# Altium schematic sheet Sht1-Schem.SchDoc
size A; SheetNumber: 1; SheetTotal: 1
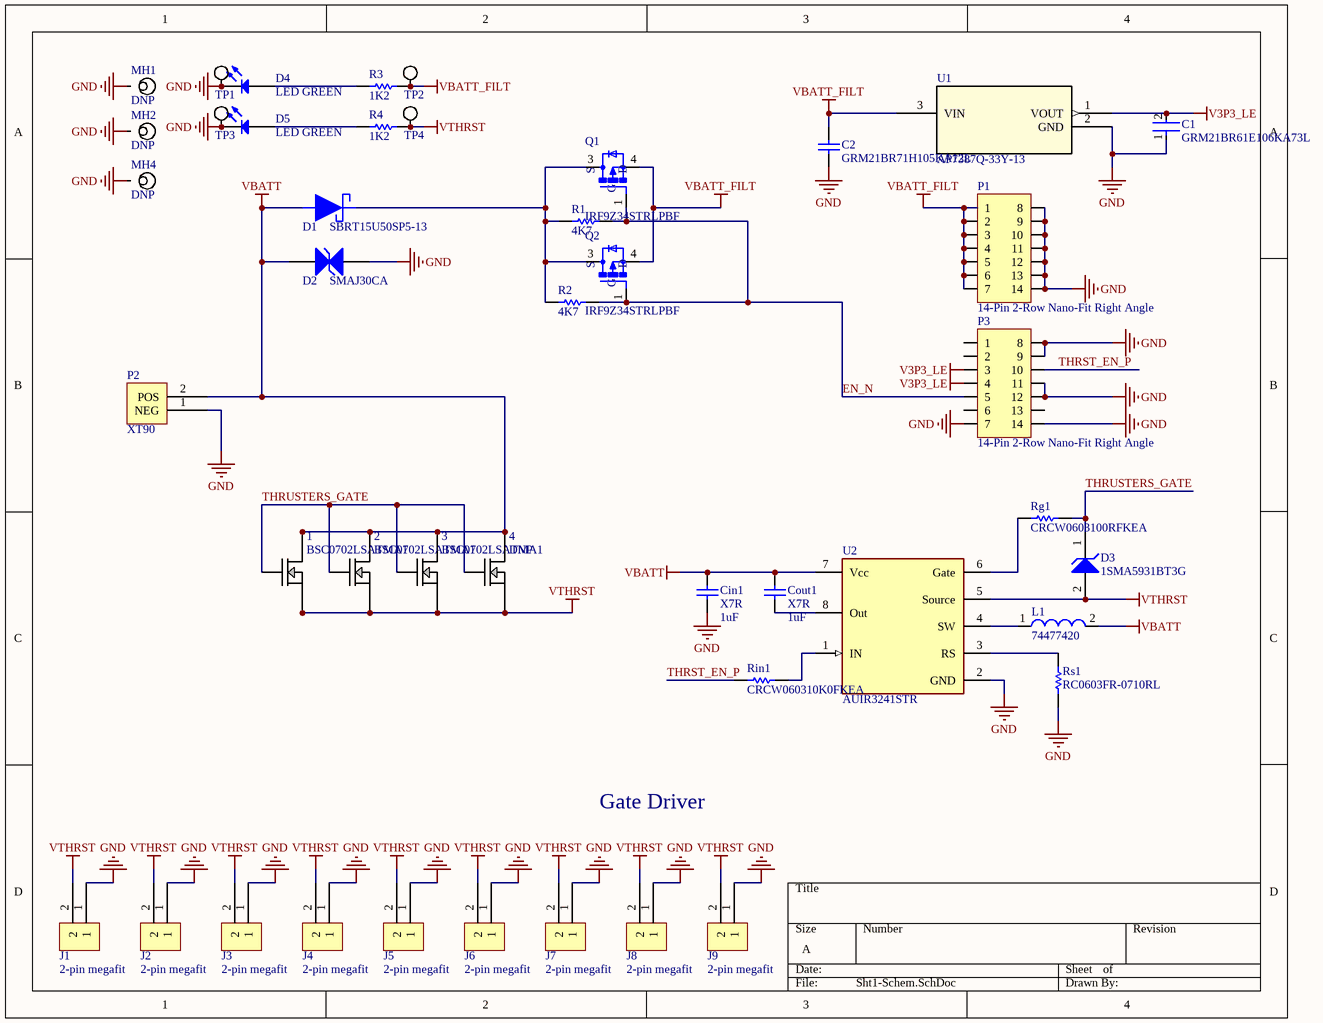
[diagram p0: Sht1-Schem.SchDoc]

## Parts
1  BSC0702LSATMA1  [TRANS_NexFET_Q5A]
2  BSC0702LSATMA1  [TRANS_NexFET_Q5A]
3  BSC0702LSATMA1  [TRANS_NexFET_Q5A]
4  DNP  [TRANS_NexFET_Q5A]
C1  GRM21BR61E106KA73L  [FP-GRM21B-0_15-IPC_C]
C2  GRM21BR71H105KA12L  [CAPC2013X135X45LL10T25]
Cin1  X7R  value 1uF  [C0805]
Cout1  X7R  value 1uF  [C0805]
D1  SBRT15U50SP5-13  [SBRT15U50SP5-13]
D2  SMAJ30CA  [LFUS-DO-214AC-A-2_V]
D3  1SMA5931BT3G  [ONSC-SMA-2-403D-02_F_V]
D4  LED GREEN  [LED_0805]
D5  LED GREEN  [LED_0805]
J1  2-pin megafit  [2-pin Megafit RA]
J2  2-pin megafit  [2-pin Megafit RA]
J3  2-pin megafit  [2-pin Megafit RA]
J4  2-pin megafit  [2-pin Megafit RA]
J5  2-pin megafit  [2-pin Megafit RA]
J6  2-pin megafit  [2-pin Megafit RA]
J7  2-pin megafit  [2-pin Megafit RA]
J8  2-pin megafit  [2-pin Megafit RA]
J9  2-pin megafit  [2-pin Megafit RA]
L1  74477420  [WE-PD2-M]
MH1  DNP  [Mounting Hole #4-40]
MH2  DNP  [Mounting Hole #4-40]
MH4  DNP  [Mounting Hole #4-40]
P1  14-Pin 2-Row Nano-Fit Right Angle  [MOLEX NANO-FIT 2X7 - Right Angle]
P2  XT90  [XT90]
P3  14-Pin 2-Row Nano-Fit Right Angle  [MOLEX NANO-FIT 2X7 - Right Angle]
Q1  IRF9Z34STRLPBF  [TO254P1521X483-4N]
Q2  IRF9Z34STRLPBF  [TO254P1521X483-4N]
R1  4K7  [RESC0603(1608)_L]
R2  4K7  [RESC0603(1608)_L]
R3  1K2  [RESC0603(1608)_L]
R4  1K2  [RESC0603(1608)_L]
Rg1  CRCW0603100RFKEA  [RESC1609X50X30ML8T20]
Rin1  CRCW060310K0FKEA  [RESC1609X50X30NL8T20]
Rs1  RC0603FR-0710RL  [RESC1608X55X25NL10T15]
TP1  Test Point Loop  [Test Point Loop - Black]  (value not drawn)
TP2  Test Point Loop  [Test Point Loop - Black]  (value not drawn)
TP3  Test Point Loop  [Test Point Loop - Black]  (value not drawn)
TP4  Test Point Loop  [Test Point Loop - Black]  (value not drawn)
U1  AP7387Q-33Y-13  [SOT-89-3_2P7X4P7_ONS]
U2  AUIR3241STR  [FP-PG-DSO-8-MFG]

## Nets
GND: C1.1 C2.1 Cin1.1 D2.2(A) D4.1(K) D5.1(K) J1.1 J2.1 J3.1 J4.1 J5.1 J6.1 J7.1 J8.1 J9.1 MH1.0 MH2.0 MH4.0 P1.8 P1.9 P1.10 P1.11 P1.12 P1.13 P1.14 P2.1(NEG) P3.7 P3.8 P3.9 P3.11 P3.12 P3.14 Rs1.1 TP1.1 TP3.1 U1.2(GND) U2.2(GND)
V3P3_LE: C1.2 P3.3 P3.4 U1.1(VOUT)
VBATT: 1.5(Drain) 1.6(Drain) 1.7(Drain) 1.8(Drain) 1.9(Drain) 2.5(Drain) 2.6(Drain) 2.7(Drain) 2.8(Drain) 2.9(Drain) 3.5(Drain) 3.6(Drain) 3.7(Drain) 3.8(Drain) 3.9(Drain) 4.5(Drain) 4.6(Drain) 4.7(Drain) 4.8(Drain) 4.9(Drain) Cin1.2 Cout1.2 D1.1 D2.1(A) L1.2 P2.2(POS) U2.7(Vcc)
VBATT_FILT: C2.2 P1.1 P1.2 P1.3 P1.4 P1.5 P1.6 P1.7 Q1.4(D) Q2.4(D) R3.2 TP2.1 U1.3(VIN)
VTHRST: 1.1(Source) 1.2(Source) 1.3(Source) 2.1(Source) 2.2(Source) 2.3(Source) 3.1(Source) 3.2(Source) 3.3(Source) 4.1(Source) 4.2(Source) 4.3(Source) D3.2(A) J1.2 J2.2 J3.2 J4.2 J5.2 J6.2 J7.2 J8.2 J9.2 R4.2 TP4.1 U2.5(Source)
EN_N: P3.5 Q1.1(G) Q2.1(G) R1.1 R2.1
THRST_EN_P: P3.10 Rin1.1
THRUSTERS_GATE: 1.4(Gate) 2.4(Gate) 3.4(Gate) 4.4(Gate) D3.1(K) Rg1.2
NetCout1_1: Cout1.1 U2.8(Out)
NetD1_2: D1.2 Q1.3(S) Q2.3(S) R1.2 R2.2
NetD4_2: D4.2(A) R3.1
NetD5_2: D5.2(A) R4.1
NetL1_1: L1.1 U2.4(SW)
NetRg1_1: Rg1.1 U2.6(Gate)
NetRin1_2: Rin1.2 U2.1(IN)
NetRs1_2: Rs1.2 U2.3(RS)

Not connected (* = marked no-connect by the designer): P3 1 2 6 13

## Notes on the sheet
- Gate Driver

## Library data of the parts
1-4 = BSC0702LSATMA1: No Description Available; Manufacturer_Part_Number: CSD18537NQ5A; VdsMax: 60.0; IdsMax: 50.0; Rdson45: 0.014559; QgTyp: 14.0; Vendor: Texas Instruments; Datasheet_URL: http://www.ti.com/lit/ds/symlink/csd18537nq5a.pdf; Quantity: 1; Manufacturer_Name: Texas Instruments; Copyright: Copyright (C) 2018 Accelerated Designs. All rights reserved; RefDes: RefDes; TYPE: TYPE; Value: Value
C1 = CMP-2007-03541-2: Chip Multilayer Ceramic Capacitors for General Purpose, 0805, 10uF, X5R, 15%, 10%, 25V; Length: 2mm; Depth: 1.25mm; Termination: SMD/SMT; Voltage: 25V; Height: 1.25mm; Material: Ceramic; Thickness: 0.053inch; Radiation Hardening: No; Min Operating Temperature: -55°C; Width: 0.049inch; Package Quantity: 1; Mount: Surface Mount; Dielectric: X5R; Packaging: Tape and Reel; Capacitance: 10uF; Voltage Rating (DC): 25V; Lead Free: Lead Free; Max Operating Temperature: 85°C; Case Code (Imperial): 0805; Case/Package: 0805; Tolerance: 10%; Voltage Rating: 25V; Case Code (Metric): 2012
C2 = CMP-1036-04761-2: 1uF; Manufacturer: Murata; Part Number: GRM21BR71H105KA12L
Cin1 Cout1 = Cap: Capacitor; Published: 8-Jun-2000; LatestRevisionDate: 17-Jul-2002; LatestRevisionNote: Re-released for DXP Platform.; PackageReference: RAD-0.3; Publisher: Altium Limited; PackageDescription: Radial Cap, Thru-Hole; 2 Leads; 0.3 in Pin Spacing
D1 = SBRT15U50SP5-13: Manufacturer: Diodes Incorporated; Diode Type: Super Barrier; Current - Average Rectified (Io): 15A; Speed: Fast Recovery =< 500ns, > 200mA (Io); Supplier 1: Digi-Key; Supplier Part Number 1: SBRT15U50SP5-13DICT-ND; Manufacturer Part Number: SBRT15U50SP5-13; RoHS: RoHS Compliant; Category: Discrete Semiconductor Products; Stock 1: 12134; Pricing 1: 1=0.93, 10=0.823, 100=0.6306, 500=0.49852, 1000=0.39882 (USD); Packaging: Cut Tape (CT); Part Status: Active; Capacitance @ Vr, F: -; Mounting Type: Surface Mount; Package / Case: PowerDI™ 5; Supplier Device Package: PowerDI®5; Operating Temperature - Junction: -65°C ~ 150°C; ComponentLink1URL: https://media.digikey.com/pdf/Data%20Sheets/Diodes%20PDFs/SBRT15U50SP5.pdf; ComponentLink1Description: https://media.digikey.com/pdf/Data%20Sheets/Diodes%20PDFs/SBRT15U50SP5.pdf
D2 = CMP-2000-07088-1: Transient Voltage Suppression Diode, 30 V, -65 to 150 degC, 2-Pin SMD, RoHS, Tape and Reel; Manufacturer: Littelfuse-Inc.; Current - Peak Pulse (10/1000µs): 8.3A; Power - Peak Pulse: 400W; Voltage - Breakdown (Min): 33.3V; Bidirectional Channels: 1; Power Line Protection: No; Voltage - Clamping (Max) @ Ipp: 48.4V; Voltage - Reverse Standoff (Typ): 30V; Type: Zener; Category: CircuitProtection; Datasheet Version: 11/2015; Package Description: 2-Pin Surface Mount Device, Body 4.295 x 2.595 mm; Family: TVS-Diodes; Manufacturer URL: http://www.littelfuse.com/; Series: SMAJ; Package / Case: DO-214AC,SMA; Capacitance @ Frequency: -; Package Reference: DO-214AC; Packaging: Digi-Reel®; Applications: GeneralPurpose; Mounting Technology: SurfaceMount; Mounting Type: SurfaceMount; Unidirectional Channels: -; Supplier Device Package: DO-214AC(SMA); Operating Temperature: -55°C~150°C(TJ); Datasheet URL: http://www.littelfuse.com/~/media/electronics/datasheets/tvs_diodes/littelfuse_tvs_diode_smaj_datasheet.pdf.pdf
D3 = CMP-1060-00118-1: 1.5 W Zener Voltage Regulator, 2-Pin SMA, Pb-Free, Tape and Reel; Manufacturer: On Semiconductor; VZ Typ (V): 18; Mounting Technology: Surface Mount; RoHS: Pb-Free; PackageDescription: 2-Pin Small Molded Package, J-Bend Lead, Body 2.605 x 4.315 mm; ComponentLink2Description: Datasheet; DatasheetVersion: Rev. 8; ComponentLink2URL: http://www.onsemi.com/pub_link/Collateral/1SMA5913BT3-D.PDF; ComponentLink3URL: http://www.onsemi.com/pub_link/Collateral/1SMA5913BT3-D.PDF; ComponentLink1URL: http://www.onsemi.com/; ComponentLink1Description: Manufacturer URL; Packing: Tape and Reel; ComponentLink3Description: Package Specification; PackageVersion: Rev. F, 11/2008; PartNumber: 1SMA5931BT3G; PackageReference: SMA-2-403D-02_F
D4 D5 = LED0: led; Manufacturer: Lite-On Inc.; Manufacturer Part Number: LTST-C171KGKT; Lens Color: Colorless; Lens Transparency: Clear; Millicandela Rating: 35mcd; Lens Style/Size: Rectangle with Flat Top, 1.40mm x 1.25mm; Voltage - Forward (Vf) (Typ): 2V; Current - Test: 20mA; Viewing Angle: 130°; Wavelength - Dominant: 571nm; Wavelength - Peak: 574nm; Supplier 1: Digi-Key; Supplier Part Number 1: 160-1426-1-ND; RoHS: RoHS Compliant; Category: Optoelectronics; Stock 1: 350441; Pricing 1: 1=0.31, 10=0.225, 25=0.1656, 100=0.1183, 250=0.0804, 500=0.07096, 1000=0.05558 (USD); Packaging: Cut Tape (CT); Part Status: Active; Color: Green; Mounting Type: Surface Mount; Features: -; Package / Case: 0805 (2012 Metric); Size / Dimension: 2.00mm L x 1.25mm W; Height (Max): 0.90mm; ComponentLink1URL: http://optoelectronics.liteon.com/upload/download/DS22-2000-118/LTST-C171KGKT.pdf; ComponentLink1Description: http://optoelectronics.liteon.com/upload/download/DS22-2000-118/LTST-C171KGKT.pdf
L1 = CMP-0227-00441-1: SMD Power Inductor WE-PD2, L = 100 µH; Inductance: 100 ÂµH; ComponentLink2Description: Datasheet; ComponentLink1URL: http://www.we-online.com; DatasheetVersion: ver 2, Jun-2005; ComponentLink2URL: http://www.we-online.de/katalog/media/pdf/74477420.pdf; PackageDescription: SMD Inductor, 2-Leads, Body 5.8 x 5.2 mm; PackageVersion: 2005; ComponentLink1Description: Manufacturer Link; PackageReference: WE-PD2-M
MH1 MH2 MH4 = Mounting Hole #4-40, Loose Fit: Mounting Hole for ANSI #4-40 w/ Flat Washer, Loose Fit; Datasheet: http://blogs.mentor.com/tom-hausherr/blog/tag/pcb-mounting-holes/
P1 P3 = 14-Pin 2-Row Nano-Fit Right Angle: NanoFit Right Hdr TH DR 14Ckt; Part Number: 105314-1214; Manufacturer: Molex; Supplier: Mouser; Supplier Part Number: 538-105314-1214; Supplier 1: Mouser; Supplier Part Number 1: 538-105314-1214; ComponentLink1Description: Mouser Link; ComponentLink1URL: https://www.mouser.com/ProductDetail/Molex/105314-1214?qs=PqFvFmEiOr6wLIXpvlvqbA%3D%3D
Q1 Q2 = IRF9Z34STRLPBF: P-Channel 60V 18A _Tc_ 3.7W _Ta_, 88W _Tc_ Surface Mount D2PAK; MF: Vishay; Package: D2PAK Vishay; Value: *; Availability: Unavailable; MP: IRF9Z34STRLPBF; Price: None; SnapEDA_Link: https://www.snapeda.com/parts/IRF9Z34STRLPBF/Vishay%20Siliconix/view-part/813693/?ref=snap
R1 R2 = CMP-1012-00586-1: 4K7 0.1W 1% 0603 (1608 Metric)  SMD; Case-EIA: 0603; Case-Metric: 1608; Value: 4700.00 Ohm; Power: 0.1 W; Tolerance: 1 %; Technology: SMT
R3 R4 = CMP-1012-00518-1: 1K2 0.1W 1% 0603 (1608 Metric)  SMD; Case-EIA: 0603; Value: 1200.00 Ohm; Case-Metric: 1608; Power: 0.1 W; Technology: SMT; Tolerance: 1 %
Rg1 = CMP-2000-03824-5: Chip Resistor, 100 Ohm, +/- 1%, 100 mW,-55 to 155 degC, 0603 (1608 Metric), RoHS, Tape and Ree; Manufacturer: Vishay Semiconductor; ComponentLink2URL: http://www.vishay.com/docs/20035/dcrcwe3.pdf; ComponentLink1URL: http://www.vishay.com/; Mounting Technology: Surface Mount; ComponentLink1Description: Manufacturer URL; ComponentLink2Description: Datasheet; PackageDescription: 2-Pin Surface Mount Device, Body 1.575 x 0.85 mm; PackageReference: 0603; DatasheetVersion: 06/2012
Rin1 = CMP-1666-00005-4: Chip Resistor, 10 KOhm, +/- 1%, 100 mW, -55 to 155 degC, 0603 (1608 Metric), RoHS, Tape and Reel; Manufacturer: Vishay Semiconductor; Voltage Rating: 75 V; Max Operating Temperature: 155 degC; PackageDescription: 2-Pin Surface Mount Device, Body 1.575 x 0.85 mm; ComponentLink1Description: Manufacturer URL; RoHSCompliant: true; PackageReference: 0603; REACH SVHC: Unknown; Length: 1.55 mm; DatasheetVersion: 06/2012; Packaging: Tape and Reel; Min Operating Temperature: -55 degC; Mounting Technology: Surface Mount; ComponentLink2URL: https://datasheet.ciiva.com/11809/0900766b80d98afc-11809037.pdf; Height: 0.45 mm; ComponentLink2Description: Datasheet; Package Quantity: 5000; ComponentLink1URL: http://www.vishay.com/
Rs1 = CMP-1659-00008-4: Chip Resistor, 10 Ohm, +/- 1%, 0.1 W, -55 to 155 degC, 0603 (1608 Metric), RoHS, Tape and Reel; Manufacturer: Yageo; Voltage Rating: 50 V; PackageReference: 0603; ComponentLink3Description: Package Specification; Packaging: Tape and Reel; Max Operating Temperature: 155 degC; ComponentLink3URL: http://www.farnell.com/datasheets/443971.pdf; PackageDescription: 2-Pin Surface Mount Device, Body 1.6 x 0.8 mm; ComponentLink1URL: http://www.yageo.com/; Pins: 2; REACH SVHC: No SVHC; RoHSCompliant: true; ComponentLink2URL: http://www.yageo.com/documents/recent/PYu-RC_Group_51_RoHS_L_04.pdf; DatasheetVersion: Rev. 4, 02/2016; Mount: Surface Mount; Package Quantity: 200; Min Operating Temperature: -55 degC; Height: 0.45 mm; Mounting Technology: Surface Mount; ComponentLink1Description: Manufacturer URL; ComponentLink2Description: Datasheet; Length: 1.6 mm
TP1-TP4 = Test Point Loop: Keyston Electronics 5001 Test Point Loop; Manufacturer P/N: 5001; Manufacturer: Keystone Electronics; Color: Black; Supplier 1: Digi-Key; Supplier Part Number 1: 36-5001-ND
U1 = AP7387Q-33Y-13: No Description Available; Mfr_Name: onsemi; RefDes: RefDes; Type: Type
U2 = CMP-32851-000034-1: IC GATE DRVR HIGH-SIDE 8SO; Output Current: 300mA; Number of Drivers: 1; Mount: Surface Mount; Packaging: Cut Tape; RoHS Compliant: Yes; Lead Free: Lead Free; Max Operating Temperature: 150°C; Min Operating Temperature: -40°C; Halogen Free: Halogen Free; Number of Pins: 8; Case/Package: SOIC